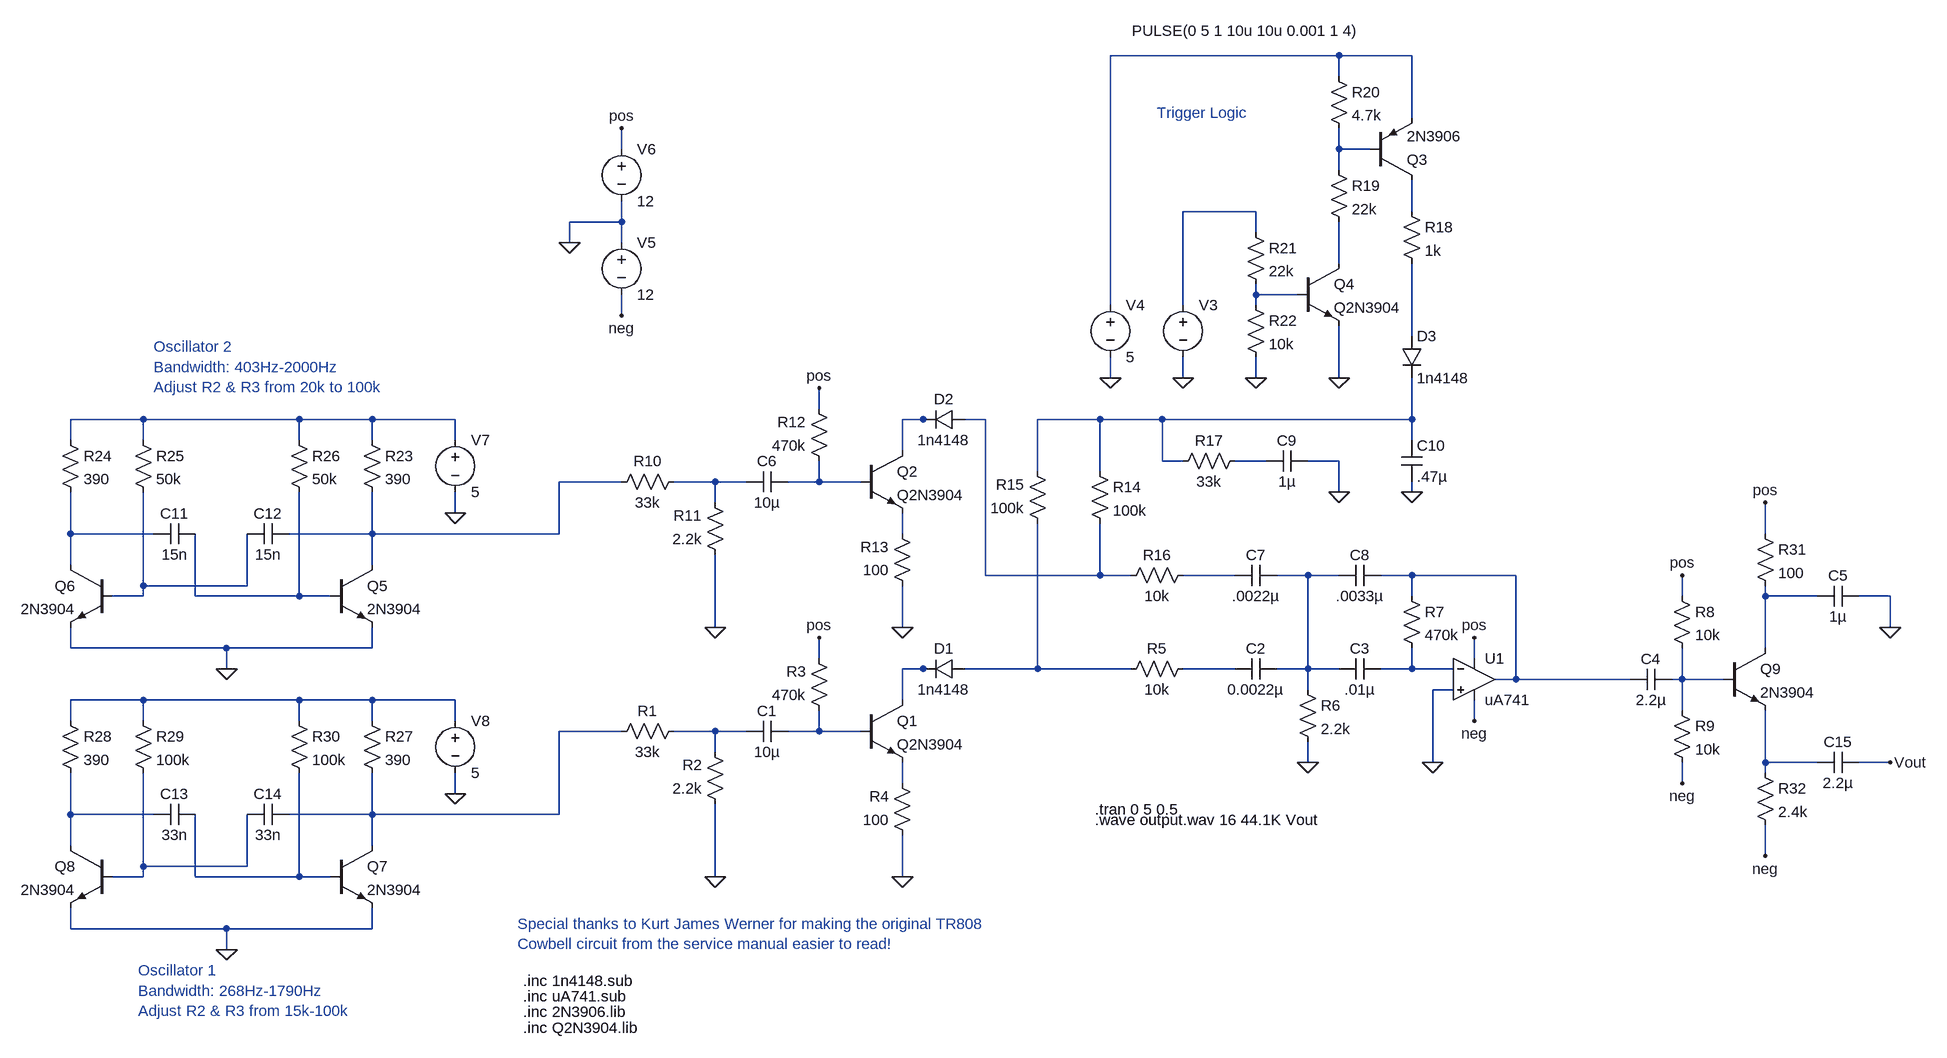
[diagram p0: schematic Cowbell.asc]
Cowbell.asc, the LTspice schematic file:
Version 4
SHEET 1 2272 680
WIRE 1184 -1040 832 -1040
WIRE 1296 -1040 1184 -1040
WIRE 1184 -1008 1184 -1040
WIRE 1296 -944 1296 -1040
WIRE 80 -896 80 -928
WIRE 1184 -896 1184 -928
WIRE 1232 -896 1184 -896
WIRE 1184 -864 1184 -896
WIRE 1056 -800 944 -800
WIRE 1296 -800 1296 -848
WIRE 80 -784 80 -816
WIRE 80 -784 0 -784
WIRE 1056 -768 1056 -800
WIRE 0 -752 0 -784
WIRE 80 -752 80 -784
WIRE 1184 -720 1184 -784
WIRE 1056 -672 1056 -688
WIRE 1120 -672 1056 -672
WIRE 832 -656 832 -1040
WIRE 944 -656 944 -800
WIRE 1056 -656 1056 -672
WIRE 80 -640 80 -672
WIRE 1296 -608 1296 -720
WIRE 832 -544 832 -576
WIRE 944 -544 944 -576
WIRE 1056 -544 1056 -576
WIRE 1184 -544 1184 -624
WIRE 384 -496 384 -528
WIRE -656 -480 -768 -480
WIRE -416 -480 -656 -480
WIRE -304 -480 -416 -480
WIRE -176 -480 -304 -480
WIRE 544 -480 512 -480
WIRE 560 -480 544 -480
WIRE 640 -480 608 -480
WIRE 816 -480 720 -480
WIRE 912 -480 816 -480
WIRE 1296 -480 1296 -544
WIRE 1296 -480 912 -480
WIRE -768 -448 -768 -480
WIRE -656 -448 -656 -480
WIRE -416 -448 -416 -480
WIRE -304 -448 -304 -480
WIRE -176 -448 -176 -480
WIRE 1296 -448 1296 -480
WIRE 512 -432 512 -480
WIRE 912 -416 912 -480
WIRE 944 -416 912 -416
WIRE 1072 -416 1024 -416
WIRE 1184 -416 1136 -416
WIRE 720 -400 720 -480
WIRE 816 -400 816 -480
WIRE 80 -384 -16 -384
WIRE 224 -384 160 -384
WIRE 272 -384 224 -384
WIRE 384 -384 384 -416
WIRE 384 -384 336 -384
WIRE 448 -384 384 -384
WIRE 1184 -368 1184 -416
WIRE 1296 -368 1296 -384
WIRE 224 -352 224 -384
WIRE -176 -336 -176 -368
WIRE -768 -304 -768 -368
WIRE -640 -304 -768 -304
WIRE -304 -304 -304 -368
WIRE -304 -304 -432 -304
WIRE -16 -304 -16 -384
WIRE -16 -304 -304 -304
WIRE 512 -304 512 -336
WIRE 1840 -304 1840 -352
WIRE -768 -256 -768 -304
WIRE -304 -256 -304 -304
WIRE 640 -240 640 -480
WIRE 816 -240 816 -320
WIRE 816 -240 640 -240
WIRE 864 -240 816 -240
WIRE 1024 -240 944 -240
WIRE 1136 -240 1088 -240
WIRE 1184 -240 1136 -240
WIRE 1296 -240 1248 -240
WIRE 1456 -240 1296 -240
WIRE -656 -224 -656 -368
WIRE -496 -224 -496 -304
WIRE -496 -224 -656 -224
WIRE -656 -208 -656 -224
WIRE -656 -208 -704 -208
WIRE -576 -208 -576 -304
WIRE -416 -208 -416 -368
WIRE -416 -208 -576 -208
WIRE -368 -208 -416 -208
WIRE 1296 -208 1296 -240
WIRE 1712 -208 1712 -240
WIRE 1840 -208 1840 -224
WIRE 1920 -208 1840 -208
WIRE 2032 -208 1984 -208
WIRE 224 -160 224 -272
WIRE 512 -160 512 -224
WIRE 2032 -160 2032 -208
WIRE -768 -128 -768 -160
WIRE -528 -128 -768 -128
WIRE -304 -128 -304 -160
WIRE -304 -128 -528 -128
WIRE 1840 -128 1840 -208
WIRE 384 -112 384 -144
WIRE 1392 -112 1392 -144
WIRE -528 -96 -528 -128
WIRE 544 -96 512 -96
WIRE 560 -96 544 -96
WIRE 720 -96 720 -320
WIRE 720 -96 608 -96
WIRE 864 -96 720 -96
WIRE 1024 -96 944 -96
WIRE 1136 -96 1136 -240
WIRE 1136 -96 1088 -96
WIRE 1184 -96 1136 -96
WIRE 1296 -96 1296 -128
WIRE 1296 -96 1248 -96
WIRE 1360 -96 1296 -96
WIRE 1456 -80 1456 -240
WIRE 1456 -80 1424 -80
WIRE 1632 -80 1456 -80
WIRE 1712 -80 1712 -128
WIRE 1712 -80 1696 -80
WIRE 1776 -80 1712 -80
WIRE 1136 -64 1136 -96
WIRE 1360 -64 1328 -64
WIRE -656 -48 -768 -48
WIRE -416 -48 -656 -48
WIRE -304 -48 -416 -48
WIRE -176 -48 -304 -48
WIRE 512 -48 512 -96
WIRE 1712 -32 1712 -80
WIRE -768 -16 -768 -48
WIRE -656 -16 -656 -48
WIRE -416 -16 -416 -48
WIRE -304 -16 -304 -48
WIRE -176 -16 -176 -48
WIRE 1392 -16 1392 -48
WIRE 80 0 -16 0
WIRE 224 0 160 0
WIRE 272 0 224 0
WIRE 384 0 384 -32
WIRE 384 0 336 0
WIRE 448 0 384 0
WIRE 224 32 224 0
WIRE 1136 48 1136 16
WIRE 1328 48 1328 -64
WIRE 1840 48 1840 -32
WIRE 1920 48 1840 48
WIRE 2032 48 1984 48
WIRE 1840 64 1840 48
WIRE 512 80 512 48
WIRE 1712 80 1712 48
WIRE -176 96 -176 64
WIRE -768 128 -768 64
WIRE -640 128 -768 128
WIRE -304 128 -304 64
WIRE -304 128 -432 128
WIRE -16 128 -16 0
WIRE -16 128 -304 128
WIRE -768 176 -768 128
WIRE -304 176 -304 128
WIRE 1840 192 1840 144
WIRE -656 208 -656 64
WIRE -496 208 -496 128
WIRE -496 208 -656 208
WIRE -656 224 -656 208
WIRE -656 224 -704 224
WIRE -576 224 -576 128
WIRE -416 224 -416 64
WIRE -416 224 -576 224
WIRE -368 224 -416 224
WIRE 224 224 224 112
WIRE 512 224 512 160
WIRE -768 304 -768 272
WIRE -528 304 -768 304
WIRE -304 304 -304 272
WIRE -304 304 -528 304
WIRE -528 336 -528 304
FLAG 224 224 0
FLAG 512 224 0
FLAG 224 -160 0
FLAG 512 -160 0
FLAG 1136 48 0
FLAG 1328 48 0
FLAG 1184 -368 0
FLAG 1296 -368 0
FLAG 832 -544 0
FLAG 944 -544 0
FLAG 1056 -544 0
FLAG 1184 -544 0
FLAG 0 -752 0
FLAG 80 -928 pos
FLAG 80 -640 neg
FLAG 384 -528 pos
FLAG 384 -144 pos
FLAG 1392 -144 pos
FLAG 1392 -16 neg
FLAG -176 -336 0
FLAG -528 -96 0
FLAG -176 96 0
FLAG -528 336 0
FLAG 1712 80 neg
FLAG 1840 192 neg
FLAG 2032 -160 0
FLAG 1712 -240 pos
FLAG 1840 -352 pos
FLAG 2032 48 Vout
SYMBOL res 176 -16 R90
WINDOW 0 0 56 VBottom 2
WINDOW 3 32 56 VTop 2
SYMATTR InstName R1
SYMATTR Value 33k
SYMBOL res 240 128 R180
WINDOW 0 36 76 Left 2
WINDOW 3 36 40 Left 2
SYMATTR InstName R2
SYMATTR Value 2.2k
SYMBOL res 400 -16 R180
WINDOW 0 36 76 Left 2
WINDOW 3 36 40 Left 2
SYMATTR InstName R3
SYMATTR Value 470k
SYMBOL res 528 176 R180
WINDOW 0 36 76 Left 2
WINDOW 3 36 40 Left 2
SYMATTR InstName R4
SYMATTR Value 100
SYMBOL npn 448 -48 R0
SYMATTR InstName Q1
SYMATTR Value Q2N3904
SYMBOL cap 336 -16 R90
WINDOW 0 0 32 VBottom 2
WINDOW 3 32 32 VTop 2
SYMATTR InstName C1
SYMATTR Value 10µ
SYMBOL diode 608 -112 R90
WINDOW 0 0 32 VBottom 2
WINDOW 3 32 32 VTop 2
SYMATTR InstName D1
SYMATTR Value 1n4148
SYMATTR Prefix X
SYMBOL cap 1088 -112 R90
WINDOW 0 0 32 VBottom 2
WINDOW 3 32 32 VTop 2
SYMATTR InstName C2
SYMATTR Value 0.0022µ
SYMBOL res 1120 -80 R0
SYMATTR InstName R6
SYMATTR Value 2.2k
SYMBOL cap 1248 -112 R90
WINDOW 0 0 32 VBottom 2
WINDOW 3 32 32 VTop 2
SYMATTR InstName C3
SYMATTR Value .01µ
SYMBOL res 1280 -224 R0
SYMATTR InstName R7
SYMATTR Value 470k
SYMBOL Opamps\\opamp2 1392 -144 R0
SYMATTR InstName U1
SYMATTR Value uA741
SYMBOL res 176 -400 R90
WINDOW 0 0 56 VBottom 2
WINDOW 3 32 56 VTop 2
SYMATTR InstName R10
SYMATTR Value 33k
SYMBOL res 240 -256 R180
WINDOW 0 36 76 Left 2
WINDOW 3 36 40 Left 2
SYMATTR InstName R11
SYMATTR Value 2.2k
SYMBOL res 400 -400 R180
WINDOW 0 36 76 Left 2
WINDOW 3 36 40 Left 2
SYMATTR InstName R12
SYMATTR Value 470k
SYMBOL res 528 -208 R180
WINDOW 0 36 76 Left 2
WINDOW 3 36 40 Left 2
SYMATTR InstName R13
SYMATTR Value 100
SYMBOL npn 448 -432 R0
SYMATTR InstName Q2
SYMATTR Value Q2N3904
SYMBOL cap 336 -400 R90
WINDOW 0 0 32 VBottom 2
WINDOW 3 32 32 VTop 2
SYMATTR InstName C6
SYMATTR Value 10µ
SYMBOL diode 608 -496 R90
WINDOW 0 0 32 VBottom 2
WINDOW 3 32 32 VTop 2
SYMATTR InstName D2
SYMATTR Value 1n4148
SYMATTR Prefix X
SYMBOL res 736 -304 R180
WINDOW 0 36 76 Left 2
WINDOW 3 36 40 Left 2
SYMATTR InstName R15
SYMATTR Value 100k
SYMBOL res 800 -416 R0
SYMATTR InstName R14
SYMATTR Value 100k
SYMBOL res 960 -256 R90
WINDOW 0 0 56 VBottom 2
WINDOW 3 32 56 VTop 2
SYMATTR InstName R16
SYMATTR Value 10k
SYMBOL cap 1088 -256 R90
WINDOW 0 0 32 VBottom 2
WINDOW 3 32 32 VTop 2
SYMATTR InstName C7
SYMATTR Value .0022µ
SYMBOL cap 1248 -256 R90
WINDOW 0 0 32 VBottom 2
WINDOW 3 32 32 VTop 2
SYMATTR InstName C8
SYMATTR Value .0033µ
SYMBOL res 960 -112 R90
WINDOW 0 0 56 VBottom 2
WINDOW 3 32 56 VTop 2
SYMATTR InstName R5
SYMATTR Value 10k
SYMBOL res 1040 -432 R90
WINDOW 0 0 56 VBottom 2
WINDOW 3 32 56 VTop 2
SYMATTR InstName R17
SYMATTR Value 33k
SYMBOL cap 1136 -432 R90
WINDOW 0 0 32 VBottom 2
WINDOW 3 32 32 VTop 2
SYMATTR InstName C9
SYMATTR Value 1µ
SYMBOL cap 1280 -448 R0
SYMATTR InstName C10
SYMATTR Value .47µ
SYMBOL diode 1280 -608 R0
SYMATTR InstName D3
SYMATTR Value 1n4148
SYMATTR Prefix X
SYMBOL res 1280 -816 R0
SYMATTR InstName R18
SYMATTR Value 1k
SYMBOL res 1168 -880 R0
SYMATTR InstName R19
SYMATTR Value 22k
SYMBOL res 1168 -1024 R0
SYMATTR InstName R20
SYMATTR Value 4.7k
SYMBOL npn 1120 -720 R0
SYMATTR InstName Q4
SYMATTR Value Q2N3904
SYMBOL res 1040 -784 R0
SYMATTR InstName R21
SYMATTR Value 22k
SYMBOL res 1040 -672 R0
SYMATTR InstName R22
SYMATTR Value 10k
SYMBOL voltage 944 -672 R0
WINDOW 3 -79 -406 Left 2
WINDOW 123 0 0 Left 0
WINDOW 39 0 0 Left 0
SYMATTR Value PULSE(0 5 1 10u 10u 0.001 1 4)
SYMATTR InstName V3
SYMBOL voltage 832 -672 R0
WINDOW 123 0 0 Left 0
WINDOW 39 0 0 Left 0
SYMATTR InstName V4
SYMATTR Value 5
SYMBOL voltage 80 -768 R0
WINDOW 123 0 0 Left 0
WINDOW 39 0 0 Left 0
SYMATTR InstName V5
SYMATTR Value 12
SYMBOL voltage 80 -912 R0
WINDOW 123 0 0 Left 0
WINDOW 39 0 0 Left 0
SYMATTR InstName V6
SYMATTR Value 12
SYMBOL pnp 1232 -848 M180
SYMATTR InstName Q3
SYMATTR Value 2N3906
SYMBOL npn -368 -256 R0
SYMATTR InstName Q5
SYMATTR Value 2N3904
SYMBOL npn -704 -256 M0
SYMATTR InstName Q6
SYMATTR Value 2N3904
SYMBOL res -320 -464 R0
SYMATTR InstName R23
SYMATTR Value 390
SYMBOL res -784 -464 R0
SYMATTR InstName R24
SYMATTR Value 390
SYMBOL res -672 -464 R0
SYMATTR InstName R25
SYMATTR Value 50k
SYMBOL res -432 -464 R0
SYMATTR InstName R26
SYMATTR Value 50k
SYMBOL cap -576 -320 R90
WINDOW 0 0 32 VBottom 2
WINDOW 3 32 32 VTop 2
SYMATTR InstName C11
SYMATTR Value 15n
SYMBOL cap -432 -320 R90
WINDOW 0 0 32 VBottom 2
WINDOW 3 32 32 VTop 2
SYMATTR InstName C12
SYMATTR Value 15n
SYMBOL voltage -176 -464 R0
WINDOW 123 0 0 Left 0
WINDOW 39 0 0 Left 0
SYMATTR InstName V7
SYMATTR Value 5
SYMBOL npn -368 176 R0
SYMATTR InstName Q7
SYMATTR Value 2N3904
SYMBOL npn -704 176 M0
SYMATTR InstName Q8
SYMATTR Value 2N3904
SYMBOL res -320 -32 R0
SYMATTR InstName R27
SYMATTR Value 390
SYMBOL res -784 -32 R0
SYMATTR InstName R28
SYMATTR Value 390
SYMBOL res -672 -32 R0
SYMATTR InstName R29
SYMATTR Value 100k
SYMBOL res -432 -32 R0
SYMATTR InstName R30
SYMATTR Value 100k
SYMBOL cap -576 112 R90
WINDOW 0 0 32 VBottom 2
WINDOW 3 32 32 VTop 2
SYMATTR InstName C13
SYMATTR Value 33n
SYMBOL cap -432 112 R90
WINDOW 0 0 32 VBottom 2
WINDOW 3 32 32 VTop 2
SYMATTR InstName C14
SYMATTR Value 33n
SYMBOL voltage -176 -32 R0
WINDOW 123 0 0 Left 0
WINDOW 39 0 0 Left 0
SYMATTR InstName V8
SYMATTR Value 5
SYMBOL npn 1776 -128 R0
SYMATTR InstName Q9
SYMATTR Value 2N3904
SYMBOL cap 1696 -96 R90
WINDOW 0 0 32 VBottom 2
WINDOW 3 32 32 VTop 2
SYMATTR InstName C4
SYMATTR Value 2.2µ
SYMBOL res 1696 -224 R0
SYMATTR InstName R8
SYMATTR Value 10k
SYMBOL res 1696 -48 R0
SYMATTR InstName R9
SYMATTR Value 10k
SYMBOL res 1824 -320 R0
SYMATTR InstName R31
SYMATTR Value 100
SYMBOL res 1824 48 R0
SYMATTR InstName R32
SYMATTR Value 2.4k
SYMBOL cap 1984 -224 R90
WINDOW 0 0 32 VBottom 2
WINDOW 3 32 32 VTop 2
SYMATTR InstName C5
SYMATTR Value 1µ
SYMBOL cap 1984 32 R90
WINDOW 0 0 32 VBottom 2
WINDOW 3 32 32 VTop 2
SYMATTR InstName C15
SYMATTR Value 2.2µ
TEXT -72 456 Left 2 !.inc Q2N3904.lib
TEXT -80 296 Left 2 ;Special thanks to Kurt James Werner for making the original TR808\nCowbell circuit from the service manual easier to read!
TEXT -72 384 Left 2 !.inc 1n4148.sub
TEXT -72 408 Left 2 !.inc uA741.sub
TEXT 808 120 Left 2 !.tran 0 5 0.5
TEXT 808 136 Left 2 !.wave output.wav 16 44.1K Vout
TEXT 904 -952 Left 2 ;Trigger Logic
TEXT -72 432 Left 2 !.inc 2N3906.lib
TEXT -640 -592 Left 2 ;Oscillator 2\nBandwidth: 403Hz-2000Hz\nAdjust R2 & R3 from 20k to 100k
TEXT -664 368 Left 2 ;Oscillator 1\nBandwidth: 268Hz-1790Hz\nAdjust R2 & R3 from 15k-100k

The netlist it stands for:
* Cowbell.asc
R1 N031 N030 33k
R2 0 N031 2.2k
R3 N032 pos 470k
R4 0 N034 100
Q1 N024 N032 N034 0 Q2N3904
C1 N032 N031 10µ
XD1 N025 N024 1n4148  ; pins + -
C2 N019 N026 0.0022µ
R6 N019 0 2.2k
C3 N027 N019 .01µ
R7 N020 N027 470k
XU1 0 N027 pos neg N020 uA741  ; pins In+ In- V+ V- OUT
R10 N014 N013 33k
R11 0 N014 2.2k
R12 N015 pos 470k
R13 0 N017 100
Q2 N009 N015 N017 0 Q2N3904
C6 N015 N014 10µ
XD2 N010 N009 1n4148  ; pins + -
R15 N025 N011 100k
R14 N011 N010 100k
R16 N018 N010 10k
C7 N019 N018 .0022µ
C8 N020 N019 .0033µ
R5 N026 N025 10k
R17 N012 N011 33k
C9 0 N012 1µ
C10 N011 0 .47µ
XD3 N007 N011 1n4148  ; pins + -
R18 N004 N007 1k
R19 N002 N005 22k
R20 N001 N002 4.7k
Q4 N005 N006 0 0 Q2N3904
R21 N003 N006 22k
R22 N006 0 10k
V3 N003 0 PULSE(0 5 1 10u 10u 0.001 1 4)
V4 N001 0 5
V5 0 neg 12
V6 pos 0 12
Q3 N004 N002 N001 0 2N3906
Q5 N013 N022 0 0 2N3904
Q6 N016 N021 0 0 2N3904
R23 N008 N013 390
R24 N008 N016 390
R25 N008 N021 50k
R26 N008 N022 50k
C11 N022 N016 15n
C12 N013 N021 15n
V7 N008 0 5
Q7 N030 N037 0 0 2N3904
Q8 N035 N036 0 0 2N3904
R27 N029 N030 390
R28 N029 N035 390
R29 N029 N036 100k
R30 N029 N037 100k
C13 N037 N035 33n
C14 N030 N036 33n
V8 N029 0 5
Q9 N023 N028 N033 0 2N3904
C4 N028 N020 2.2µ
R8 pos N028 10k
R9 N028 neg 10k
R31 pos N023 100
R32 N033 neg 2.4k
C5 0 N023 1µ
C15 Vout N033 2.2µ
.model NPN NPN
.model PNP PNP
.lib standard.bjt
.inc Q2N3904.lib
* Special thanks to Kurt James Werner for making the original TR808
* Cowbell circuit from the service manual easier to read!
.inc 1n4148.sub
.inc uA741.sub
.tran 0 5 0.5
.wave output.wav 16 44.1K Vout
* Trigger Logic
.inc 2N3906.lib
* Oscillator 2
* Bandwidth: 403Hz-2000Hz
* Adjust R2 & R3 from 20k to 100k
* Oscillator 1
* Bandwidth: 268Hz-1790Hz
* Adjust R2 & R3 from 15k-100k
.backanno
.end